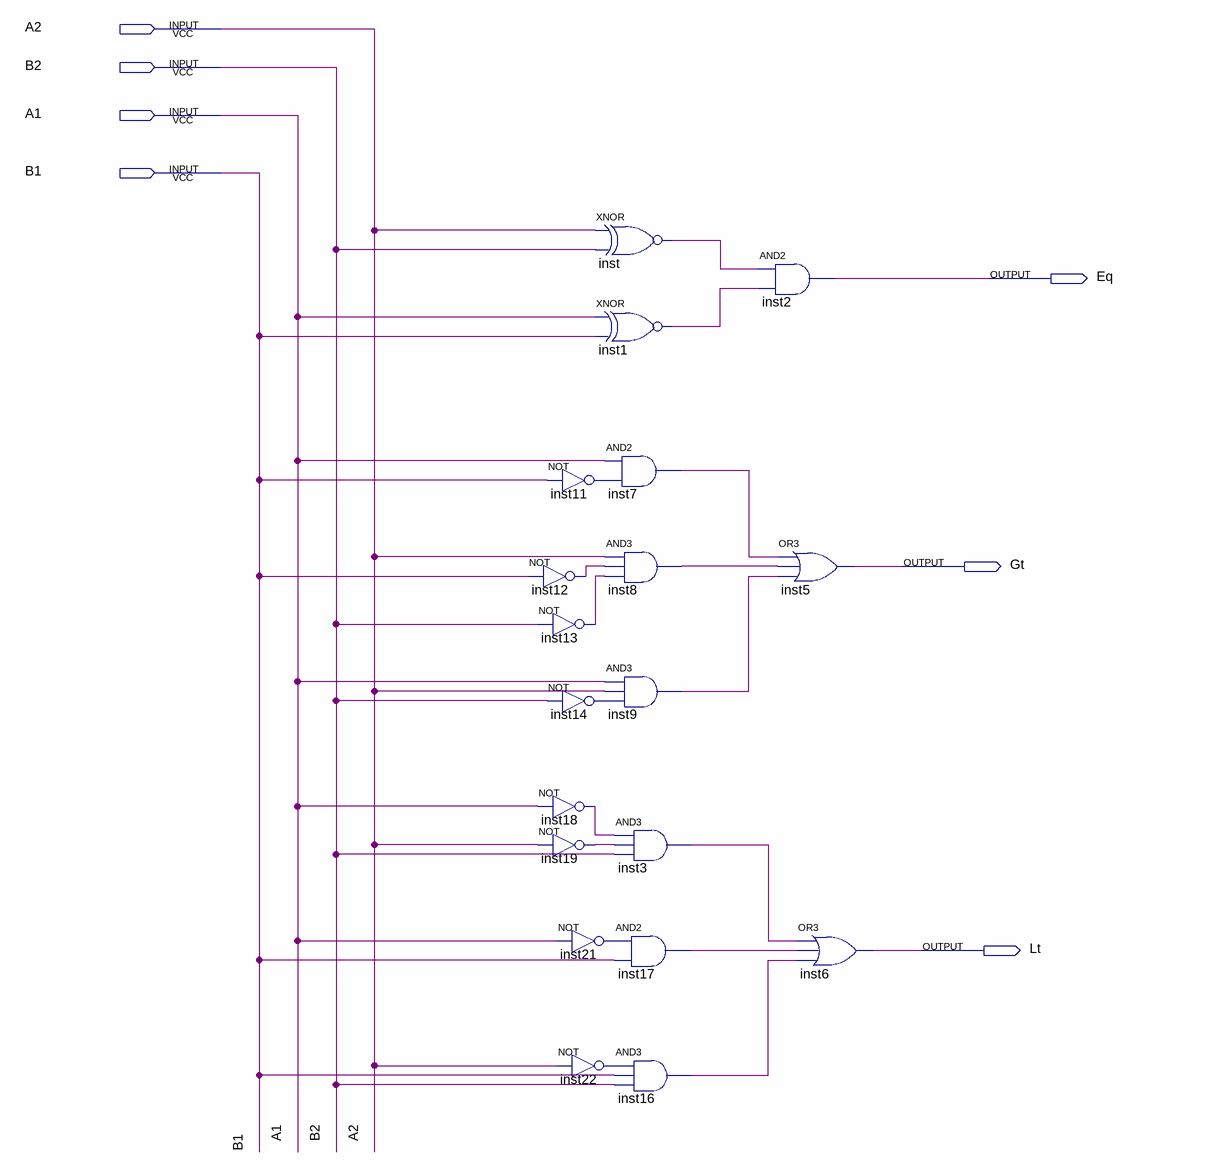
[diagram p0: schematic sheet]
// Quartus schematic 2_bits_compare.bdf as structural Verilog: 19 symbols, 7 pins
module \2_bits_compare  (
  input  A2,
  input  B2,
  input  A1,
  input  B1,
  output Eq,
  output Gt,
  output Lt
);

  wire inst1_out, inst3_out, inst7_out, inst8_out, inst9_out, inst11_out, inst12_out, inst13_out, inst14_out,
       inst16_out, inst17_out, inst18_out, inst19_out, inst21_out, inst22_out, inst_out;

  xnor inst (inst_out, A2, B2);
  xnor inst1 (inst1_out, A1, B1);
  not inst11 (inst11_out, B1);
  not inst12 (inst12_out, B1);
  not inst13 (inst13_out, B2);
  not inst14 (inst14_out, B2);
  not inst18 (inst18_out, A1);
  not inst19 (inst19_out, A2);
  not inst21 (inst21_out, A1);
  not inst22 (inst22_out, A2);
  and inst7 (inst7_out, A1, inst11_out);
  and inst8 (inst8_out, A2, inst12_out, inst13_out);
  and inst9 (inst9_out, A1, A2, inst14_out);
  and inst3 (inst3_out, inst18_out, inst19_out, B2);
  and inst17 (inst17_out, inst21_out, B1);
  and inst16 (inst16_out, inst22_out, B1, B2);
  and inst2 (Eq, inst_out, inst1_out);
  or inst5 (Gt, inst7_out, inst8_out, inst9_out);
  or inst6 (Lt, inst3_out, inst17_out, inst16_out);
endmodule
